# EAGLE schematic sparrow_ble_mic (EAGLE 6.1)
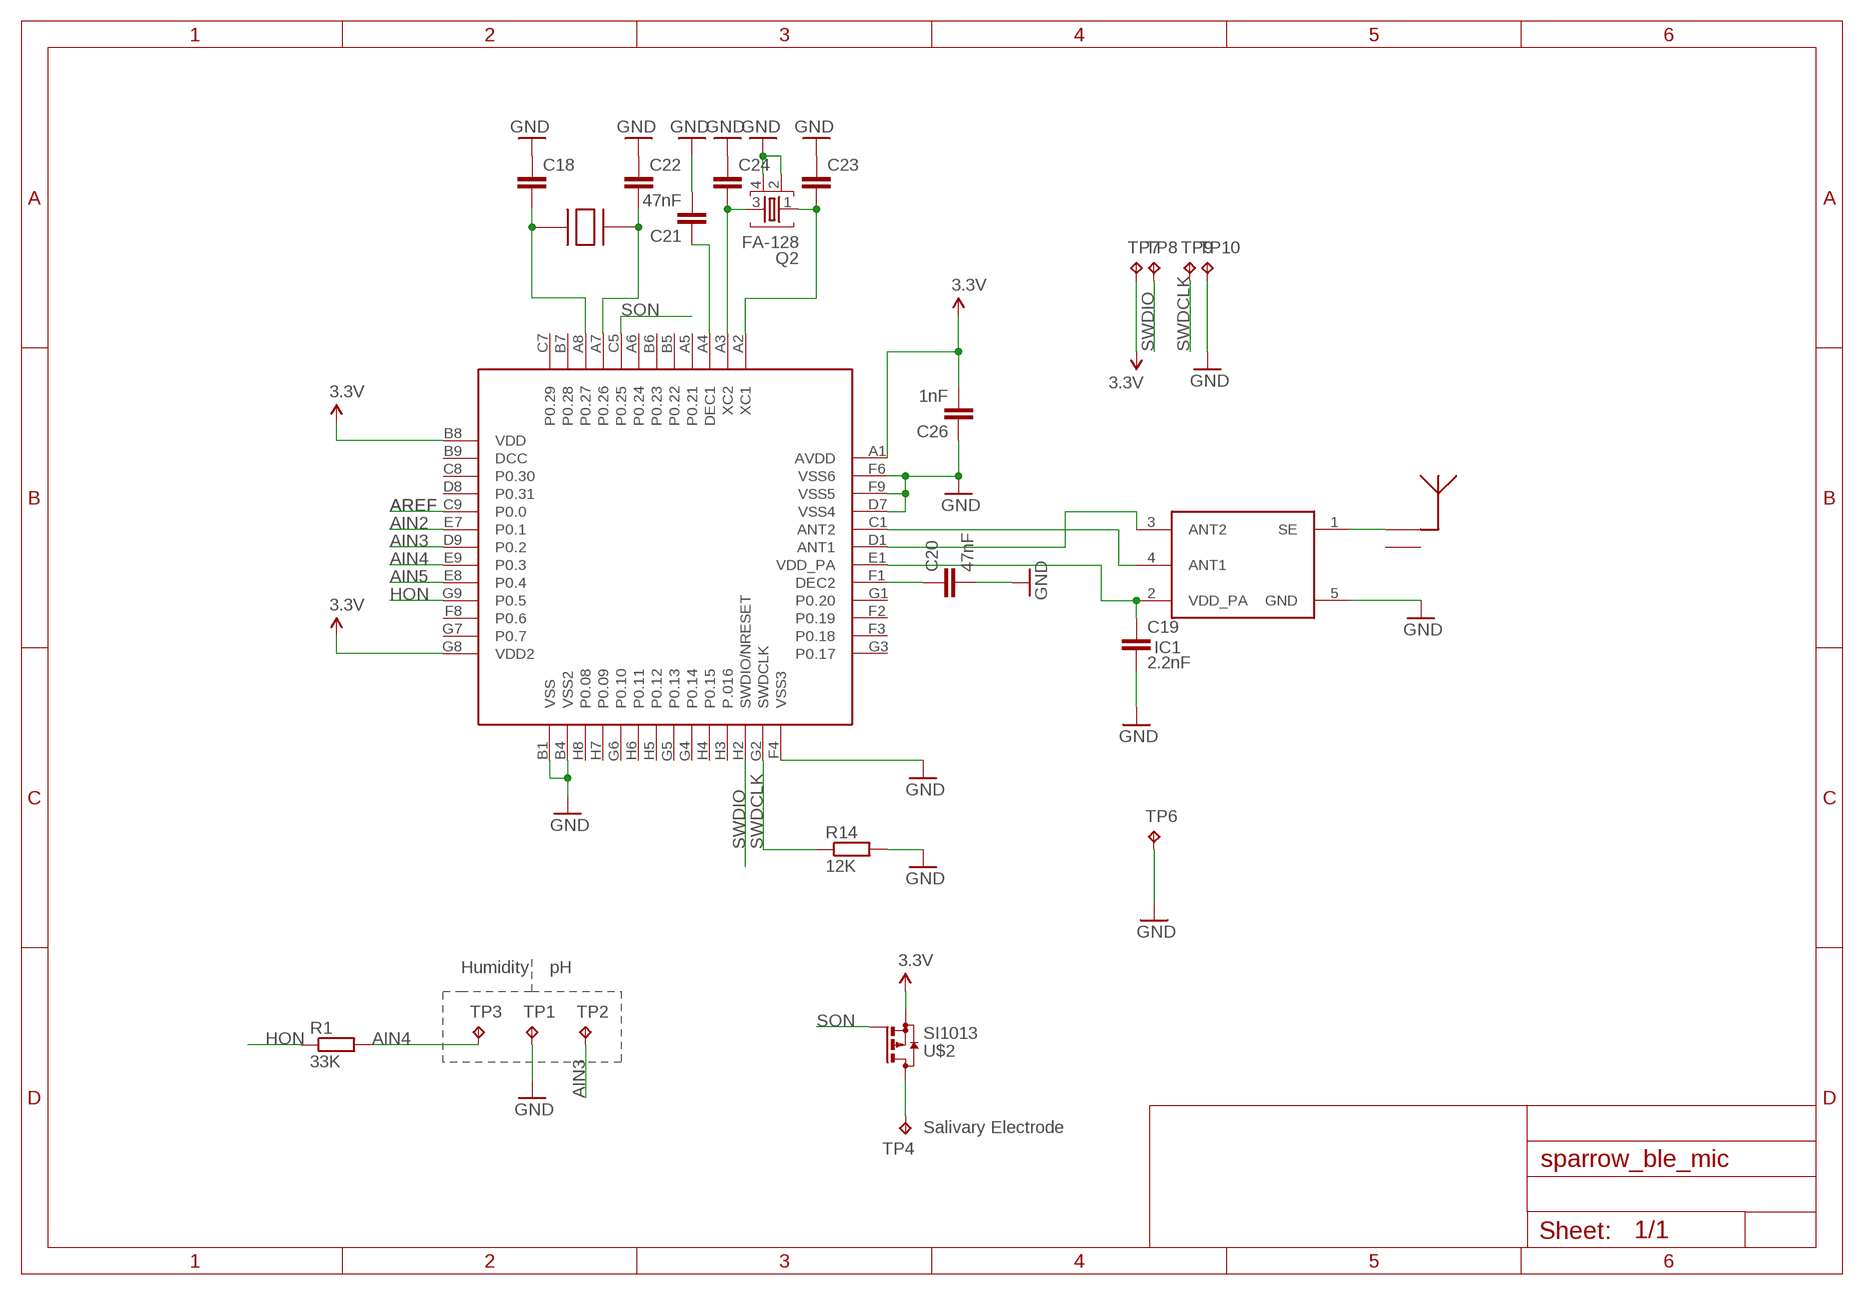
[diagram p0: schematic, sheet 1]

## Parts
C18  C-EUC0201  [C0201]
C19  2.2nF  C-EUC0201  [C0201]
C20  47nF  C-EUC0201  [C0201]
C21  47nF  C-EUC0201  [C0201]
C22  C-EUC0201  [C0201]
C23  C-EUC0201  [C0201]
C24  C-EUC0201  [C0201]
C26  1nF  C-EUC0201  [C0201]
IC1  2450BM08B0003T  [2450BM08B0003T]
IC3  NRF51822_WLCSP  [WLCSP-CDAB62]
Q2  FA-128  [FA-128]
R1  33K  R-EU_R0201  [R0201]
R14  12K  R-EU_R0201  [R0201]
TP1  TPTP10R  [TP10R]
TP2  TPTP10R  [TP10R]
TP3  TPTP10R  [TP10R]
TP4  TPTP10R  [TP10R]
TP6  TPTP20R  [TP20R]
TP7  TPTP15R  [TP15R]
TP8  TPTP15R  [TP15R]
TP9  TPTP15R  [TP15R]
TP10  TPTP15R  [TP15R]
U$1  2450AT18A100  [2450AT18A100]
U$2  SI1013  [SC75_INFINEON]
U$4  ABS05  [ABS05]

## Nets
3.3V: C26.2 IC3.A1(AVDD) IC3.B8(VDD) IC3.G8(VDD2) TP7.TP U$2.2(S)
AIN2: IC3.E7(P0.1)
AIN3: IC3.D9(P0.2) TP2.TP
AIN4: IC3.E9(P0.3) R1.2 TP3.TP
AIN5: IC3.E8(P0.4)
AREF: IC3.C9(P0.0)
GND: C18.1 C19.2 C20.2 C21.2 C22.1 C23.1 C24.1 C26.1 IC1.5(GND) IC3.B1(VSS) IC3.B4(VSS2) IC3.D7(VSS4) IC3.F4(VSS3) IC3.F6(VSS6) IC3.F9(VSS5) Q2.2 Q2.4 R14.2 TP1.TP TP6.TP TP10.TP
HON: IC3.G9(P0.5) R1.1
N$1: IC1.4(ANT1) IC3.C1(ANT2)
N$3: IC1.3(ANT2) IC3.D1(ANT1)
N$4: IC1.1(SE) U$1.P$1
N$5: TP4.TP U$2.3(D)
N$7: C18.2 IC3.A8(P0.27) U$4.P$1
N$8: C22.2 IC3.A7(P0.26) U$4.P$2
N$11: C21.1 IC3.A4(DEC1)
N$15: C20.1 IC3.F1(DEC2)
N$16: C19.1 IC1.2(VDD_PA) IC3.E1(VDD_PA)
N$17: C24.2 IC3.A3(XC2) Q2.3
N$18: C23.2 IC3.A2(XC1) Q2.1
SON: IC3.C5(P0.25) U$2.1(G)
SWDCLK: IC3.G2(SWDCLK) R14.1 TP9.TP
SWDIO: IC3.H2(SWDIO/NRESET) TP8.TP
Unconnected: IC3.A5(P0.21) IC3.A6(P0.24) IC3.B5(P0.22) IC3.B6(P0.23) IC3.B7(P0.28) IC3.B9(DCC) IC3.C7(P0.29) IC3.C8(P0.30) IC3.D8(P0.31) IC3.F2(P0.19) IC3.F3(P0.18) IC3.F8(P0.6) IC3.G1(P0.20) IC3.G3(P0.17) IC3.G4(P0.14) IC3.G5(P0.13) IC3.G6(P0.10) IC3.G7(P0.7) IC3.H3(P.016) IC3.H4(P0.15) IC3.H5(P0.12) IC3.H6(P0.11) IC3.H7(P0.09) IC3.H8(P0.08) U$1.P$2

## Notes on the sheet
- Humidity | pH
- Salivary Electrode

## Library data of the parts
C18-C24 C26 = rcl:C-EU: CAPACITOR, European symbol
IC1 = dan:2450BM08B0003T
IC3 = dan:NRF51822_WLCSP
Q2 = smartwatch:FA-: MHz RANGE CRYSTAL UNIT Source: Epson Toyocom
R1 R14 = rcl:R-EU_: RESISTOR, European symbol
TP1-TP4 TP6-TP10 = testpad:TP: Test pad
U$1 = dan:2450AT18A100
U$2 = smartwatch:SI1013
U$4 = dan:ABS05

## Net classes
1 power: width 0.61 mm